# Altium schematic sheet Rectifier.SchDoc
size A4
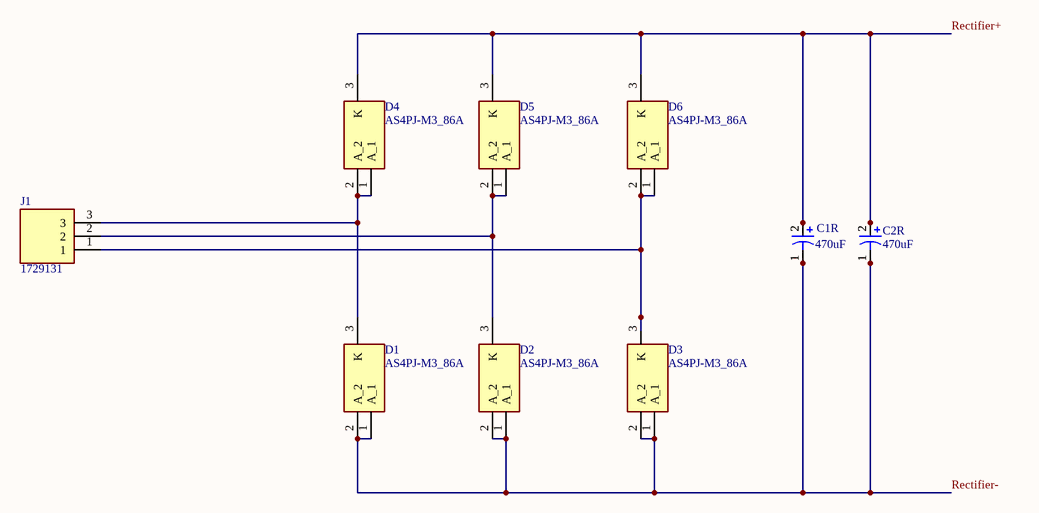
[diagram p0: Rectifier.SchDoc]

## Parts
C1R  470uF  [450MXH270MEFCSN30X30]
C2R  470uF  [450MXH270MEFCSN30X30]
D1  AS4PJ-M3_86A  [V10PN50M387A]
D2  AS4PJ-M3_86A  [V10PN50M387A]
D3  AS4PJ-M3_86A  [V10PN50M387A]
D4  AS4PJ-M3_86A  [V10PN50M387A]
D5  AS4PJ-M3_86A  [V10PN50M387A]
D6  AS4PJ-M3_86A  [V10PN50M387A]
J1  1729131  [1729131]

## Nets
Rectifier+: C1R.2(+) C2R.2(+) D4.3(K) D5.3(K) D6.3(K)
Rectifier-: C1R.1(-) C2R.1(-) D1.1(A_1) D1.2(A_2) D2.1(A_1) D2.2(A_2) D3.1(A_1) D3.2(A_2)
NetD1_3: D1.3(K) D4.1(A_1) D4.2(A_2) J1.3
NetD2_3: D2.3(K) D5.1(A_1) D5.2(A_2) J1.2
NetD3_3: D3.3(K) D6.1(A_1) D6.2(A_2) J1.1

## Library data of the parts
C1R C2R = 450MXH270MEFCSN30X30
D1-D6 = AS4PJ-M3_86A: Diode; Manufacturer_Name: Vishay; Manufacturer_Part_Number: AS4PJ-M3/86A; Datasheet Link: http://www.vishay.com/docs/88770/as4pd.pdf; Height: 1.2mm; Mouser Part Number: 625-AS4PJ-M3/86A; Mouser Price/Stock: https://www.mouser.co.uk/ProductDetail/Vishay-Semiconductors/AS4PJ-M3-86A?qs=z5NHsHGj0DEO4GI4Od5axw%3D%3D; Arrow Part Number: AS4PJ-M3/86A; Arrow Price/Stock: https://www.arrow.com/en/products/as4pj-m386a/vishay
J1 = 1729131: Connector; Manufacturer_Name: Phoenix Contact; Datasheet Link: https://componentsearchengine.com/Datasheets/2/1729131.pdf; Height: 10.15mm; Manufacturer_Part_Number: 1729131; Mouser Part Number: 651-1729131; Mouser Price/Stock: https://www.mouser.co.uk/ProductDetail/Phoenix-Contact/1729131/?qs=GFUSqQMLmmkspw%2F%2FW6PC3g%3D%3D